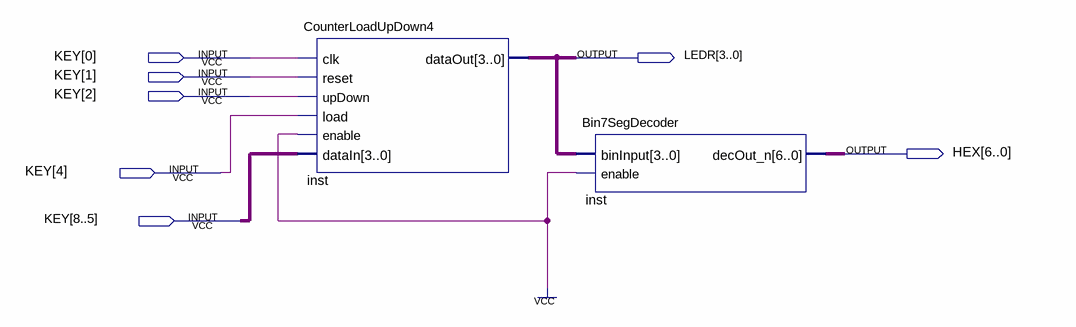
[diagram p0: schematic sheet]
// Quartus schematic Counter_Demo.bdf as structural Verilog: 2 symbols, 7 pins
module Counter_Demo (
  input  [8:0] KEY,
  output [3:0] LEDR,
  output [6:0] HEX
);

  CounterLoadUpDown4 inst (
    .clk(KEY[0]), .reset(KEY[1]), .upDown(KEY[2]), .load(KEY[4]), .enable(1'b1), .dataIn(KEY[8:5]),
    .dataOut(LEDR));
  Bin7SegDecoder inst_dup2 (.binInput(LEDR), .enable(1'b1), .decOut_n(HEX));
endmodule
